# Altium schematic sheet TopLevel.SchDoc: =project_title
size Tabloid; CompanyName: Luxonis Holding; Organization: Luxonis Holding; Address1: 1925 Harmony Park Drive; Address2: Westminster, CO; Address3: 80234; Address4: United States; SheetNumber: 2; SheetTotal: 12
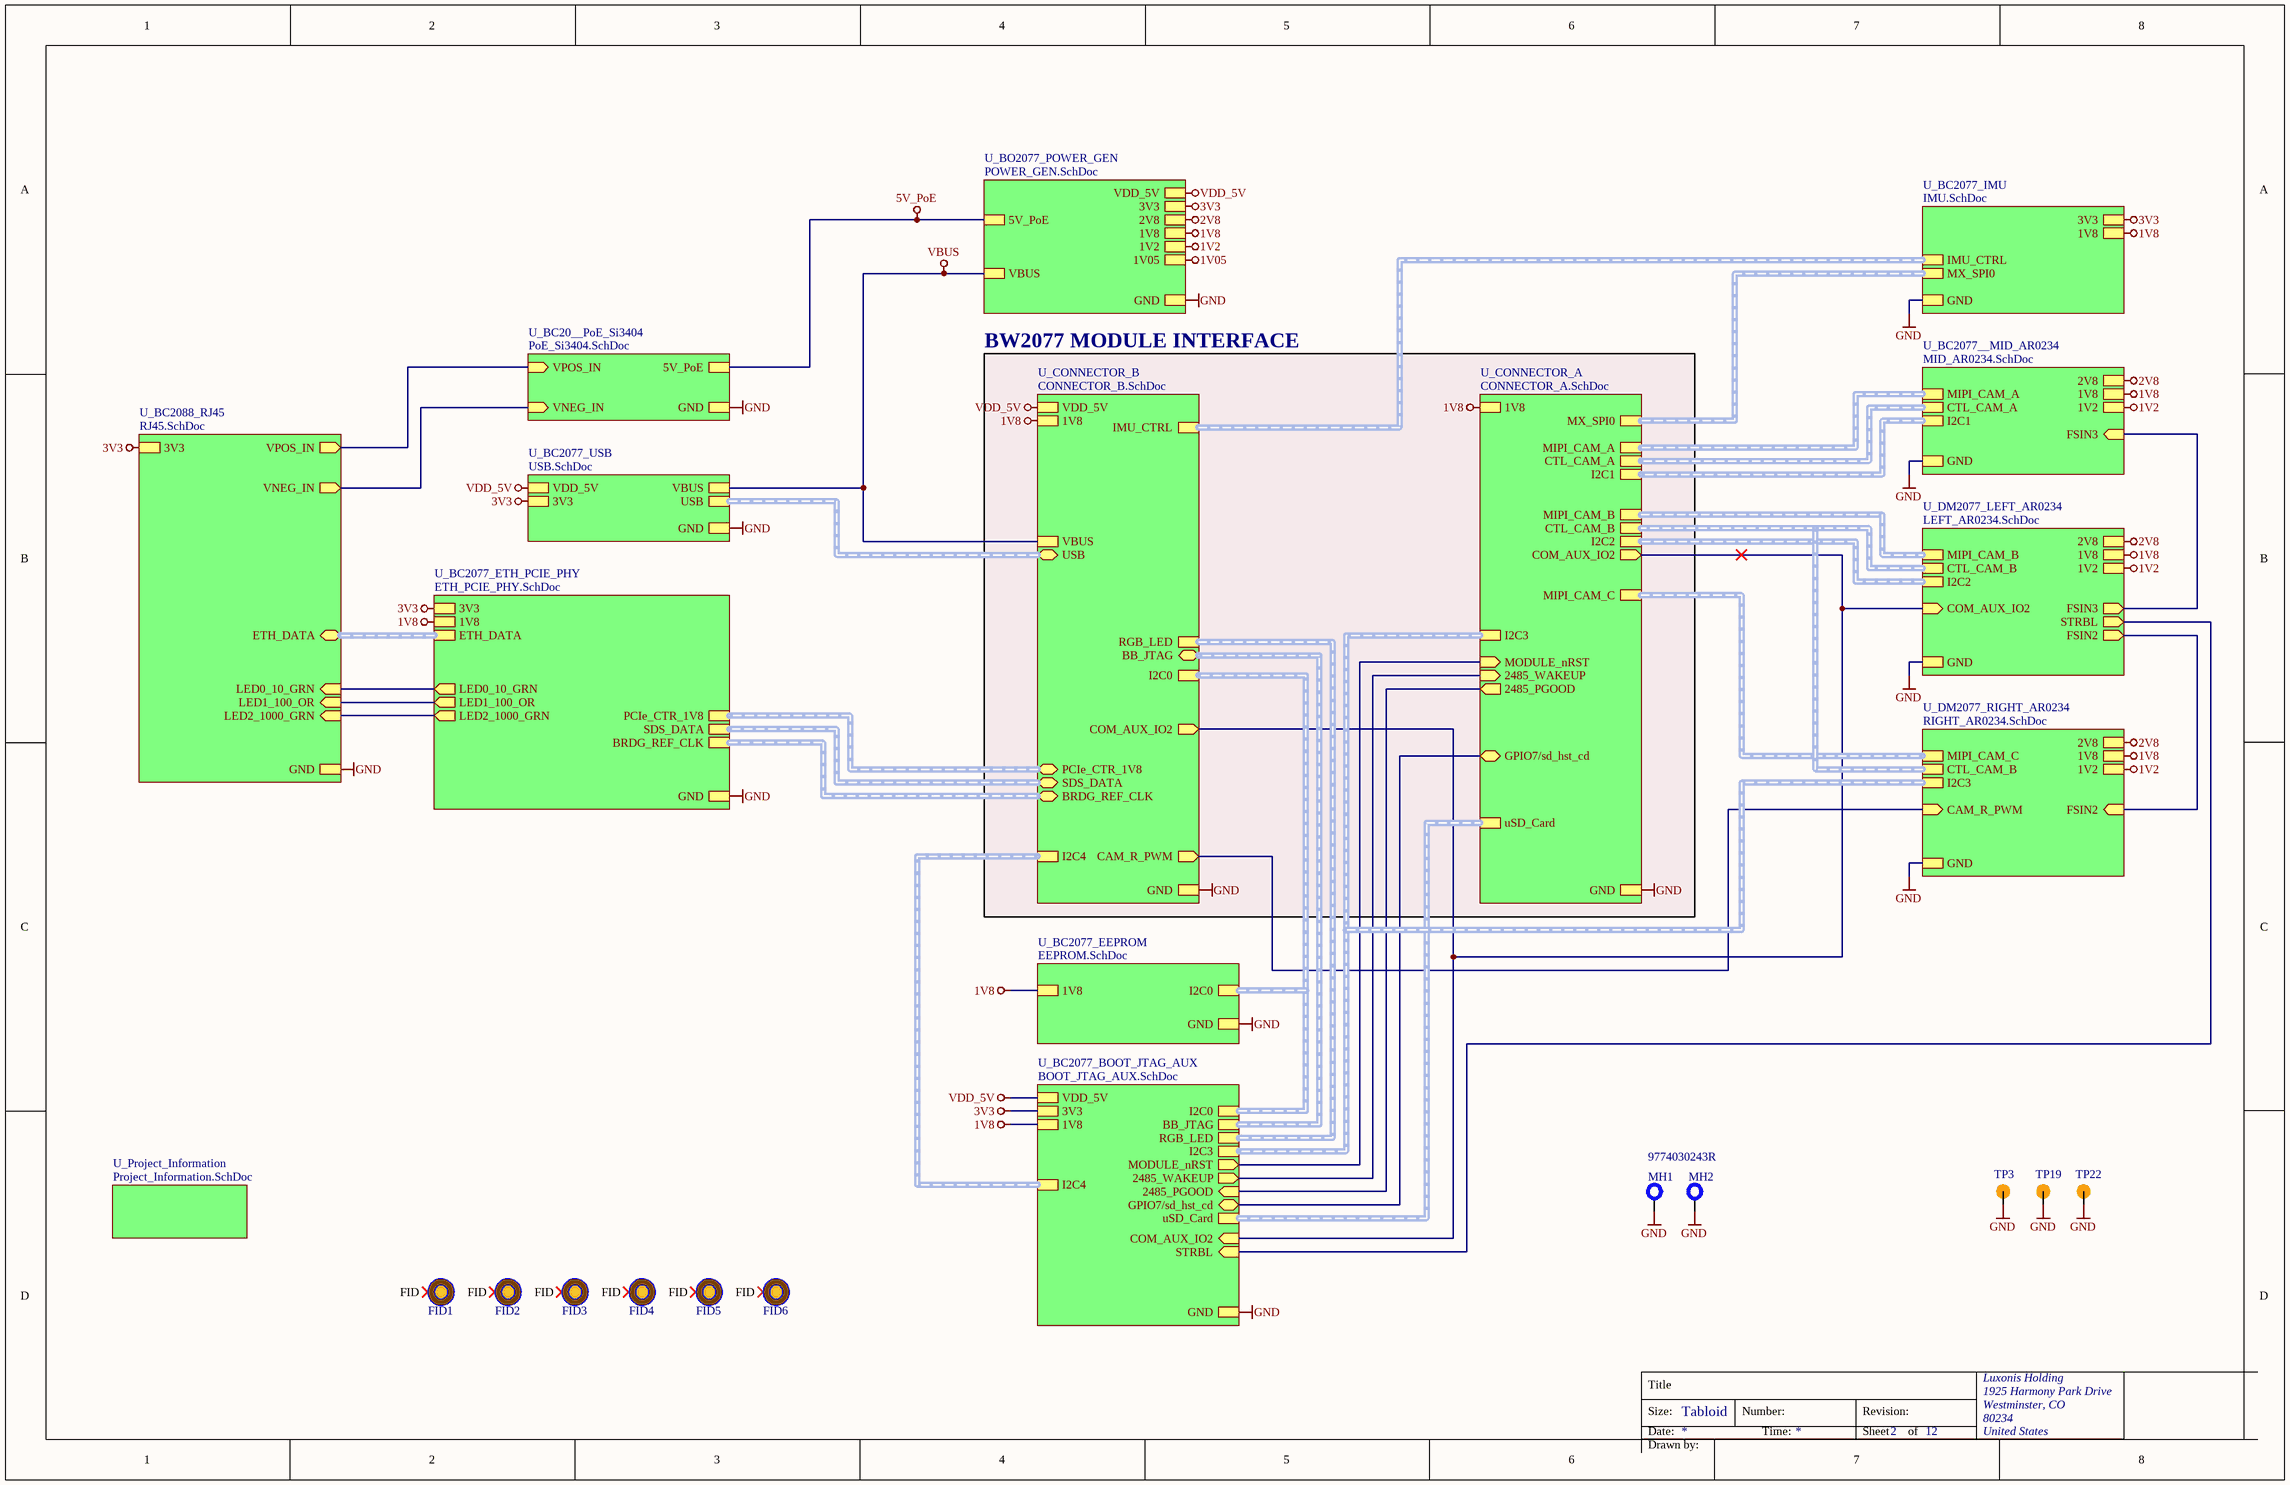
[diagram p0: TopLevel.SchDoc]

## Parts
FID1  FIDUCIAL  [FIDUCIAL_ROUND_1MM]  (value not drawn)  (no BOM)
FID2  FIDUCIAL  [FIDUCIAL_ROUND_1MM]  (value not drawn)  (no BOM)
FID3  FIDUCIAL  [FIDUCIAL_ROUND_1MM]  (value not drawn)  (no BOM)
FID4  FIDUCIAL  [FIDUCIAL_ROUND_1MM]  (value not drawn)  (no BOM)
FID5  FIDUCIAL  [FIDUCIAL_ROUND_1MM]  (value not drawn)  (no BOM)
FID6  FIDUCIAL  [FIDUCIAL_ROUND_1MM]  (value not drawn)  (no BOM)
MH1  9774030243R  [9774030243R]
MH2  9774030243R  [9774030243R]  (value not drawn)
TP3  TEST_POINT  [TP100_200_NS]  (value not drawn)  (no BOM)
TP19  TEST_POINT  [TP100_200_NS]  (value not drawn)  (no BOM)
TP22  TEST_POINT  [TP100_200_NS]  (value not drawn)  (no BOM)

## Sub-sheets
U_BC20__PoE_Si3404 = PoE_Si3404.SchDoc: 5V_PoE, GND, VPOS_IN (in), VNEG_IN (in)
U_BC2077__MID_AR0234 = MID_AR0234.SchDoc: 2V8, 1V2, I2C1 (harness I2C1), MIPI_CAM_A (harness MIPI_CAM_A), CTL_CAM_A (harness CTL_CAM_A), GND, 1V8, FSIN3 (in)
U_BC2077_BOOT_JTAG_AUX = BOOT_JTAG_AUX.SchDoc: RGB_LED (harness BOOT), BB_JTAG (harness BB_JTAG), uSD_Card (harness uSD_Card), 2485_WAKEUP (out), I2C3 (harness I2C3), MODULE_nRST (out), 2485_PGOOD (in), 1V8, 3V3, GND, VDD_5V, I2C0 (harness I2C0), GPIO7/sd_hst_cd (bidir), STRBL (in), COM_AUX_IO2 (in), I2C4 (harness I2C4)
U_BC2077_EEPROM = EEPROM.SchDoc: 1V8, GND, I2C0 (harness I2C0)
U_BC2077_ETH_PCIE_PHY = ETH_PCIE_PHY.SchDoc: ETH_DATA (harness ETH_DATA), LED0_10_GRN (out), LED1_100_OR (out), LED2_1000_GRN (out), SDS_DATA (harness Harness), 3V3, GND, BRDG_REF_CLK (harness BRDG_REF_CLK), 1V8, PCIe_CTR_1V8 (harness PCIe_CTR_1V8)
U_BC2077_IMU = IMU.SchDoc: GND, 3V3, 1V8, MX_SPI0 (harness MX_SPI0), IMU_CTRL (harness IMU_CTRL)
U_BC2077_USB = USB.SchDoc: USB (harness USB), GND, 3V3, VBUS, VDD_5V
U_BC2088_RJ45 = RJ45.SchDoc: GND, LED0_10_GRN (in), 3V3, LED2_1000_GRN (in), LED1_100_OR (in), VPOS_IN (out), VNEG_IN (out), ETH_DATA (bidir, harness ETH_DATA)
U_BO2077_POWER_GEN = POWER_GEN.SchDoc: GND, 3V3, 1V8, 5V_PoE, VBUS, 1V2, 2V8, 1V05, VDD_5V
U_CONNECTOR_A = CONNECTOR_A.SchDoc: I2C2 (harness I2C2), I2C1 (harness I2C1), uSD_Card (harness uSD_Card), MIPI_CAM_C (harness MIPI_CAM_C), CTL_CAM_A (harness CTL_CAM_A), MIPI_CAM_A (harness MIPI_CAM_A), MIPI_CAM_B (harness MIPI_CAM_B), GND, I2C3 (harness I2C3), CTL_CAM_B (harness CTL_CAM_B), COM_AUX_IO2 (out), MODULE_nRST (in), 2485_WAKEUP (in), 2485_PGOOD (out), GPIO7/sd_hst_cd (bidir), MX_SPI0 (harness MX_SPI0), 1V8
U_CONNECTOR_B = CONNECTOR_B.SchDoc: VBUS, I2C0 (harness I2C0), VDD_5V, GND, PCIe_CTR_1V8 (bidir, harness PCIe_CTR_1V8), BB_JTAG (bidir, harness BB_JTAG), USB (bidir, harness USB), SDS_DATA (bidir, harness Harness), BRDG_REF_CLK (bidir, harness BRDG_REF_CLK), IMU_CTRL (harness IMU_CTRL), RGB_LED (harness BOOT), 1V8, CAM_R_PWM (out), I2C4, COM_AUX_IO2 (out)
U_DM2077_LEFT_AR0234 = LEFT_AR0234.SchDoc: I2C2 (harness I2C2), CTL_CAM_B (harness CTL_CAM_B), MIPI_CAM_B (harness MIPI_CAM_B), 1V2, 2V8, GND, 1V8, FSIN2 (out), COM_AUX_IO2 (in), FSIN3 (out), STRBL (out)
U_DM2077_RIGHT_AR0234 = RIGHT_AR0234.SchDoc: MIPI_CAM_C (harness MIPI_CAM_C), I2C3 (harness I2C2), 1V2, 2V8, GND, 1V8, FSIN2 (in), CTL_CAM_B (harness CTL_CAM_B), CAM_R_PWM (in)
U_Project_Information = Project_Information.SchDoc: no entries

## Nets
1V2: sheet U_BO2077_POWER_GEN/1V2, sheet U_BC2077__MID_AR0234/1V2, sheet U_DM2077_RIGHT_AR0234/1V2, sheet U_DM2077_LEFT_AR0234/1V2
1V05: sheet U_BO2077_POWER_GEN/1V05
1V8: sheet U_CONNECTOR_B/1V8, sheet U_CONNECTOR_A/1V8, sheet U_BC2077_ETH_PCIE_PHY/1V8, sheet U_BC2077_BOOT_JTAG_AUX/1V8, sheet U_BO2077_POWER_GEN/1V8, sheet U_BC2077__MID_AR0234/1V8, sheet U_DM2077_RIGHT_AR0234/1V8, sheet U_DM2077_LEFT_AR0234/1V8, sheet U_BC2077_IMU/1V8, sheet U_BC2077_EEPROM/1V8
2V8: sheet U_BO2077_POWER_GEN/2V8, sheet U_BC2077__MID_AR0234/2V8, sheet U_DM2077_RIGHT_AR0234/2V8, sheet U_DM2077_LEFT_AR0234/2V8
3V3: sheet U_BC2077_ETH_PCIE_PHY/3V3, sheet U_BC2088_RJ45/3V3, sheet U_BC2077_USB/3V3, sheet U_BC2077_BOOT_JTAG_AUX/3V3, sheet U_BO2077_POWER_GEN/3V3, sheet U_BC2077_IMU/3V3
5V_PoE: sheet U_BC20__PoE_Si3404/5V_PoE, sheet U_BO2077_POWER_GEN/5V_PoE
GND: MH1.1 MH2.1 TP3.1 TP19.1 TP22.1 ; sheet U_CONNECTOR_B/GND, sheet U_CONNECTOR_A/GND, sheet U_BC2077_ETH_PCIE_PHY/GND, sheet U_BC2088_RJ45/GND, sheet U_BC2077_USB/GND, sheet U_BC2077_BOOT_JTAG_AUX/GND, sheet U_BC20__PoE_Si3404/GND, sheet U_BO2077_POWER_GEN/GND, sheet U_BC2077__MID_AR0234/GND, sheet U_DM2077_RIGHT_AR0234/GND, sheet U_DM2077_LEFT_AR0234/GND, sheet U_BC2077_IMU/GND, sheet U_BC2077_EEPROM/GND
VBUS: sheet U_CONNECTOR_B/VBUS, sheet U_BC2077_USB/VBUS, sheet U_BO2077_POWER_GEN/VBUS
VDD_5V: sheet U_CONNECTOR_B/VDD_5V, sheet U_BC2077_USB/VDD_5V, sheet U_BC2077_BOOT_JTAG_AUX/VDD_5V, sheet U_BO2077_POWER_GEN/VDD_5V
(unnamed): sheet U_CONNECTOR_B/CAM_R_PWM, sheet U_DM2077_RIGHT_AR0234/CAM_R_PWM
(unnamed): sheet U_CONNECTOR_B/COM_AUX_IO2, sheet U_CONNECTOR_A/COM_AUX_IO2, sheet U_BC2077_BOOT_JTAG_AUX/COM_AUX_IO2, sheet U_DM2077_LEFT_AR0234/COM_AUX_IO2
(unnamed): sheet U_CONNECTOR_A/MODULE_nRST, sheet U_BC2077_BOOT_JTAG_AUX/MODULE_nRST
(unnamed): sheet U_CONNECTOR_A/2485_WAKEUP, sheet U_BC2077_BOOT_JTAG_AUX/2485_WAKEUP
(unnamed): sheet U_CONNECTOR_A/2485_PGOOD, sheet U_BC2077_BOOT_JTAG_AUX/2485_PGOOD
(unnamed): sheet U_CONNECTOR_A/GPIO7/sd_hst_cd, sheet U_BC2077_BOOT_JTAG_AUX/GPIO7/sd_hst_cd
(unnamed): sheet U_BC2077_ETH_PCIE_PHY/LED0_10_GRN, sheet U_BC2088_RJ45/LED0_10_GRN
(unnamed): sheet U_BC2077_ETH_PCIE_PHY/LED1_100_OR, sheet U_BC2088_RJ45/LED1_100_OR
(unnamed): sheet U_BC2077_ETH_PCIE_PHY/LED2_1000_GRN, sheet U_BC2088_RJ45/LED2_1000_GRN
(unnamed): sheet U_BC2088_RJ45/VPOS_IN, sheet U_BC20__PoE_Si3404/VPOS_IN
(unnamed): sheet U_BC2088_RJ45/VNEG_IN, sheet U_BC20__PoE_Si3404/VNEG_IN
(unnamed): sheet U_BC2077_BOOT_JTAG_AUX/STRBL, sheet U_DM2077_LEFT_AR0234/STRBL
(unnamed): sheet U_BC2077__MID_AR0234/FSIN3, sheet U_DM2077_LEFT_AR0234/FSIN3
(unnamed): sheet U_DM2077_RIGHT_AR0234/FSIN2, sheet U_DM2077_LEFT_AR0234/FSIN2

Not connected (* = marked no-connect by the designer): FID1 FID*; FID2 FID*; FID3 FID*; FID4 FID*; FID5 FID*; FID6 FID*

## Buses and harness runs
harness sheet U_BC2077__MID_AR0234/CTL_CAM_A = sheet U_CONNECTOR_A/CTL_CAM_A
harness sheet U_BC2077__MID_AR0234/I2C1 = sheet U_CONNECTOR_A/I2C1
harness sheet U_BC2077__MID_AR0234/MIPI_CAM_A = sheet U_CONNECTOR_A/MIPI_CAM_A
harness sheet U_BC2077_BOOT_JTAG_AUX/BB_JTAG = sheet U_CONNECTOR_B/BB_JTAG
harness sheet U_BC2077_BOOT_JTAG_AUX/I2C0 = sheet U_BC2077_EEPROM/I2C0 = sheet U_CONNECTOR_B/I2C0
harness sheet U_BC2077_BOOT_JTAG_AUX/I2C3 = sheet U_CONNECTOR_A/I2C3 = sheet U_DM2077_RIGHT_AR0234/I2C3
harness sheet U_BC2077_BOOT_JTAG_AUX/I2C4 = sheet U_CONNECTOR_B/I2C4
harness sheet U_BC2077_BOOT_JTAG_AUX/RGB_LED = sheet U_CONNECTOR_B/RGB_LED
harness sheet U_BC2077_BOOT_JTAG_AUX/uSD_Card = sheet U_CONNECTOR_A/uSD_Card
harness sheet U_BC2077_ETH_PCIE_PHY/BRDG_REF_CLK = sheet U_CONNECTOR_B/BRDG_REF_CLK
harness sheet U_BC2077_ETH_PCIE_PHY/ETH_DATA = sheet U_BC2088_RJ45/ETH_DATA
harness sheet U_BC2077_ETH_PCIE_PHY/PCIe_CTR_1V8 = sheet U_CONNECTOR_B/PCIe_CTR_1V8
harness sheet U_BC2077_ETH_PCIE_PHY/SDS_DATA = sheet U_CONNECTOR_B/SDS_DATA
harness sheet U_BC2077_IMU/IMU_CTRL = sheet U_CONNECTOR_B/IMU_CTRL
harness sheet U_BC2077_IMU/MX_SPI0 = sheet U_CONNECTOR_A/MX_SPI0
harness sheet U_BC2077_USB/USB = sheet U_CONNECTOR_B/USB
harness sheet U_CONNECTOR_A/CTL_CAM_B = sheet U_DM2077_LEFT_AR0234/CTL_CAM_B = sheet U_DM2077_RIGHT_AR0234/CTL_CAM_B
harness sheet U_CONNECTOR_A/I2C2 = sheet U_DM2077_LEFT_AR0234/I2C2
harness sheet U_CONNECTOR_A/MIPI_CAM_B = sheet U_DM2077_LEFT_AR0234/MIPI_CAM_B
harness sheet U_CONNECTOR_A/MIPI_CAM_C = sheet U_DM2077_RIGHT_AR0234/MIPI_CAM_C

## Notes on the sheet
- BW2077 MODULE INTERFACE
- Title
- Size:
- Date:
- Tabloid
- Number:
- Time:
- Revision:
- Sheet
- of
- Drawn by:

## Library data of the parts
FID1-FID6 = CMP-011-000000-4: Fiducial with various available footprints; Manufacturer Part Number 1: /
MH1 MH2 = CMP-120-000000-2: MP ROUND STANDOFF M2X0.4 STEEL 3MM; Manufacturer 1: Wurth Electronics; Manufacturer Part Number 1: 9774030243R
TP3 TP19 TP22 = CMP-015-000000-2: Manufacturer Part Number 1: /; Design Item ID: TEST_POINT; Source: LuxonisMaster.SchLib